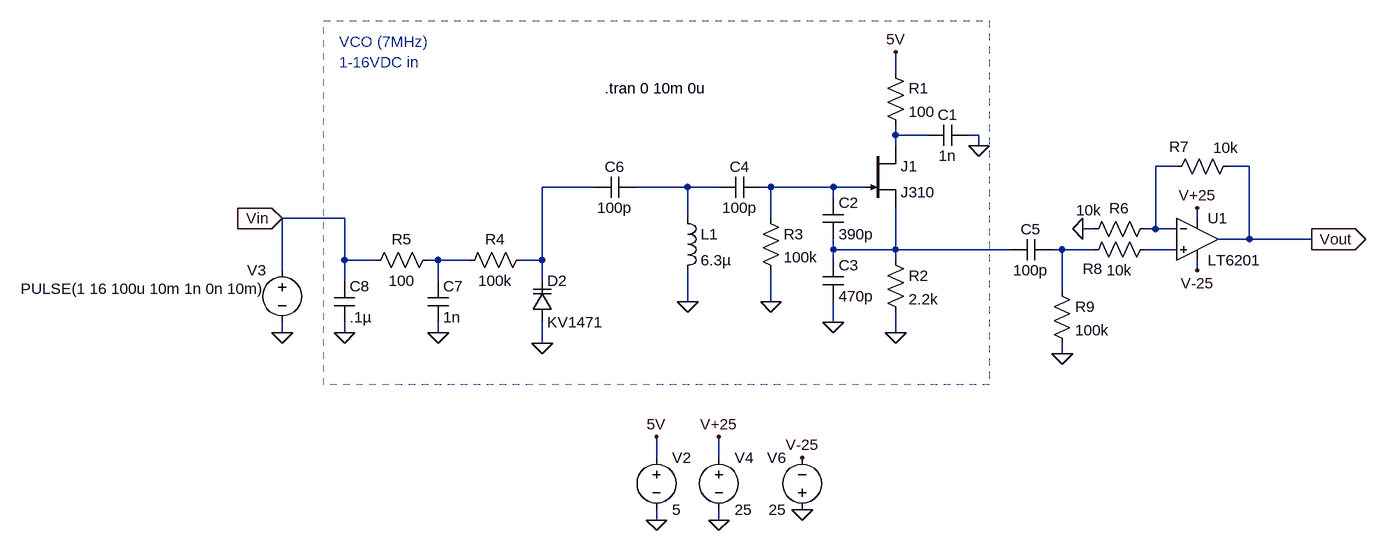
[diagram p0: schematic VCO.asc]
VCO.asc, the LTspice schematic file:
Version 4
SHEET 1 1420 868
WIRE 288 32 288 0
WIRE 288 128 288 112
WIRE 336 128 288 128
WIRE 416 128 400 128
WIRE 288 144 288 128
WIRE 416 144 416 128
WIRE 720 176 688 176
WIRE 832 176 800 176
WIRE -176 208 -256 208
WIRE -32 208 -112 208
WIRE 16 208 -32 208
WIRE 96 208 80 208
WIRE 192 208 96 208
WIRE 240 208 192 208
WIRE 192 224 192 208
WIRE -560 256 -656 256
WIRE -32 256 -32 208
WIRE 96 256 96 208
WIRE 752 256 752 240
WIRE 592 272 576 272
WIRE 688 272 688 176
WIRE 688 272 672 272
WIRE 720 272 688 272
WIRE 832 288 832 176
WIRE 832 288 784 288
WIRE 928 288 832 288
WIRE 192 304 192 288
WIRE 288 304 288 240
WIRE 288 304 192 304
WIRE 464 304 288 304
WIRE 544 304 528 304
WIRE 592 304 544 304
WIRE 720 304 672 304
WIRE -560 320 -560 256
WIRE -512 320 -560 320
WIRE -416 320 -432 320
WIRE -368 320 -416 320
WIRE -256 320 -256 208
WIRE -256 320 -288 320
WIRE 192 320 192 304
WIRE 288 320 288 304
WIRE -656 336 -656 256
WIRE 752 336 752 320
WIRE -560 352 -560 320
WIRE -416 352 -416 320
WIRE -256 352 -256 320
WIRE 544 368 544 304
WIRE -32 384 -32 336
WIRE 96 384 96 336
WIRE 192 416 192 384
WIRE -656 432 -656 416
WIRE -560 432 -560 416
WIRE -416 432 -416 416
WIRE 288 432 288 400
WIRE -256 448 -256 416
WIRE 544 464 544 448
WIRE -80 624 -80 592
WIRE 16 624 16 592
WIRE -80 720 -80 704
WIRE 16 720 16 704
FLAG -80 592 5V
FLAG -80 720 0
FLAG 416 144 0
FLAG 192 416 0
FLAG 288 432 0
FLAG 928 288 Vout
IOPIN 928 288 Out
FLAG 96 384 0
FLAG -32 384 0
FLAG -256 448 0
FLAG -560 432 0
FLAG -416 432 0
FLAG 288 0 5V
FLAG -656 432 0
FLAG 16 592 V+25
FLAG 16 720 0
FLAG 576 272 0
FLAG 544 464 0
FLAG 144 624 V-25
FLAG 752 336 V-25
FLAG 752 240 V+25
FLAG 144 704 0
FLAG -656 256 Vin
IOPIN -656 256 In
SYMBOL njf 240 144 R0
SYMATTR InstName J1
SYMATTR Value J310
SYMBOL voltage -80 608 R0
WINDOW 123 0 0 Left 0
WINDOW 39 0 0 Left 0
SYMATTR InstName V2
SYMATTR Value 5
SYMBOL res 272 16 R0
SYMATTR InstName R1
SYMATTR Value 100
SYMBOL cap 400 112 R90
WINDOW 0 0 32 VBottom 2
WINDOW 3 32 32 VTop 2
SYMATTR InstName C1
SYMATTR Value 1n
SYMBOL res 272 304 R0
SYMATTR InstName R2
SYMATTR Value 2.2k
SYMBOL cap 176 224 R0
SYMATTR InstName C2
SYMATTR Value 390p
SYMBOL cap 176 320 R0
SYMATTR InstName C3
SYMATTR Value 470p
SYMBOL res 80 240 R0
SYMATTR InstName R3
SYMATTR Value 100k
SYMBOL cap 80 192 R90
WINDOW 0 0 32 VBottom 2
WINDOW 3 32 32 VTop 2
SYMATTR InstName C4
SYMATTR Value 100p
SYMBOL ind -48 240 R0
SYMATTR InstName L1
SYMATTR Value 6.3µ
SYMBOL cap -112 192 R90
WINDOW 0 0 32 VBottom 2
WINDOW 3 32 32 VTop 2
SYMATTR InstName C6
SYMATTR Value 100p
SYMBOL varactor -272 416 M180
WINDOW 0 24 64 Left 2
WINDOW 3 24 0 Left 2
SYMATTR InstName D2
SYMATTR Value KV1471
SYMBOL res -272 304 R90
WINDOW 0 0 56 VBottom 2
WINDOW 3 32 56 VTop 2
SYMATTR InstName R4
SYMATTR Value 100k
SYMBOL res -416 304 R90
WINDOW 0 0 56 VBottom 2
WINDOW 3 32 56 VTop 2
SYMATTR InstName R5
SYMATTR Value 100
SYMBOL cap -432 352 R0
SYMATTR InstName C7
SYMATTR Value 1n
SYMBOL cap -576 352 R0
SYMATTR InstName C8
SYMATTR Value .1µ
SYMBOL voltage -656 320 M0
WINDOW 123 0 0 Left 0
WINDOW 39 0 0 Left 0
WINDOW 3 24 44 Left 2
SYMATTR Value PULSE(1 16 100u 10m 1n 0n 10m)
SYMATTR InstName V3
SYMBOL voltage 16 608 R0
WINDOW 123 0 0 Left 0
WINDOW 39 0 0 Left 0
SYMATTR InstName V4
SYMATTR Value 25
SYMBOL res 688 256 R90
WINDOW 0 0 56 VBottom 2
WINDOW 3 -28 103 VTop 2
SYMATTR InstName R6
SYMATTR Value 10k
SYMBOL res 816 160 R90
WINDOW 0 1 92 VBottom 2
WINDOW 3 -28 20 VTop 2
SYMATTR InstName R7
SYMATTR Value 10k
SYMBOL res 688 288 R90
WINDOW 0 61 97 VBottom 2
WINDOW 3 32 56 VTop 2
SYMATTR InstName R8
SYMATTR Value 10k
SYMBOL cap 528 288 R90
WINDOW 0 0 32 VBottom 2
WINDOW 3 32 32 VTop 2
SYMATTR InstName C5
SYMATTR Value 100p
SYMBOL Opamps\\LT6201 752 288 R0
SYMATTR InstName U1
SYMBOL res 528 352 R0
SYMATTR InstName R9
SYMATTR Value 100k
SYMBOL voltage 144 720 R180
WINDOW 0 24 96 Left 2
WINDOW 3 24 16 Left 2
WINDOW 123 0 0 Left 0
WINDOW 39 0 0 Left 0
SYMATTR InstName V6
SYMATTR Value 25
TEXT -568 -16 Left 2 ;VCO (7MHz)
TEXT -568 16 Left 2 ;1-16VDC in
TEXT -160 56 Left 2 !.tran 0 10m 0u
RECTANGLE Normal 432 512 -592 -48 2

The netlist it stands for:
* VCO.asc
J1 N001 N005 N006 J310
V2 5V 0 5
R1 5V N001 100
C1 0 N001 1n
R2 N006 0 2.2k
C2 N005 N006 390p
C3 N006 0 470p
R3 N005 0 100k
C4 N005 N004 100p
L1 N004 0 6.3µ
C6 N004 N003 100p
D2 0 N003 KV1471
R4 N003 N009 100k
R5 N009 Vin 100
C7 N009 0 1n
C8 Vin 0 .1µ
V3 Vin 0 PULSE(1 16 100u 10m 1n 0n 10m)
V4 V+25 0 25
R6 N002 0 10k
R7 Vout N002 10k
R8 N008 N007 10k
C5 N007 N006 100p
* U1: LT6201 (symbol Opamps\LT6201 not available, pins judged from their places): In+=N008 In-=N002 V+=V+25 V-=V-25 OUT=Vout
R9 N007 0 100k
V6 0 V-25 25
.model D D
.lib standard.dio
.model NJF NJF
.model PJF PJF
.lib standard.jft
* VCO (7MHz)
* 1-16VDC in
.tran 0 10m 0u
.backanno
.end